# EAGLE design de9-2x5 (EAGLE 6.5.0)
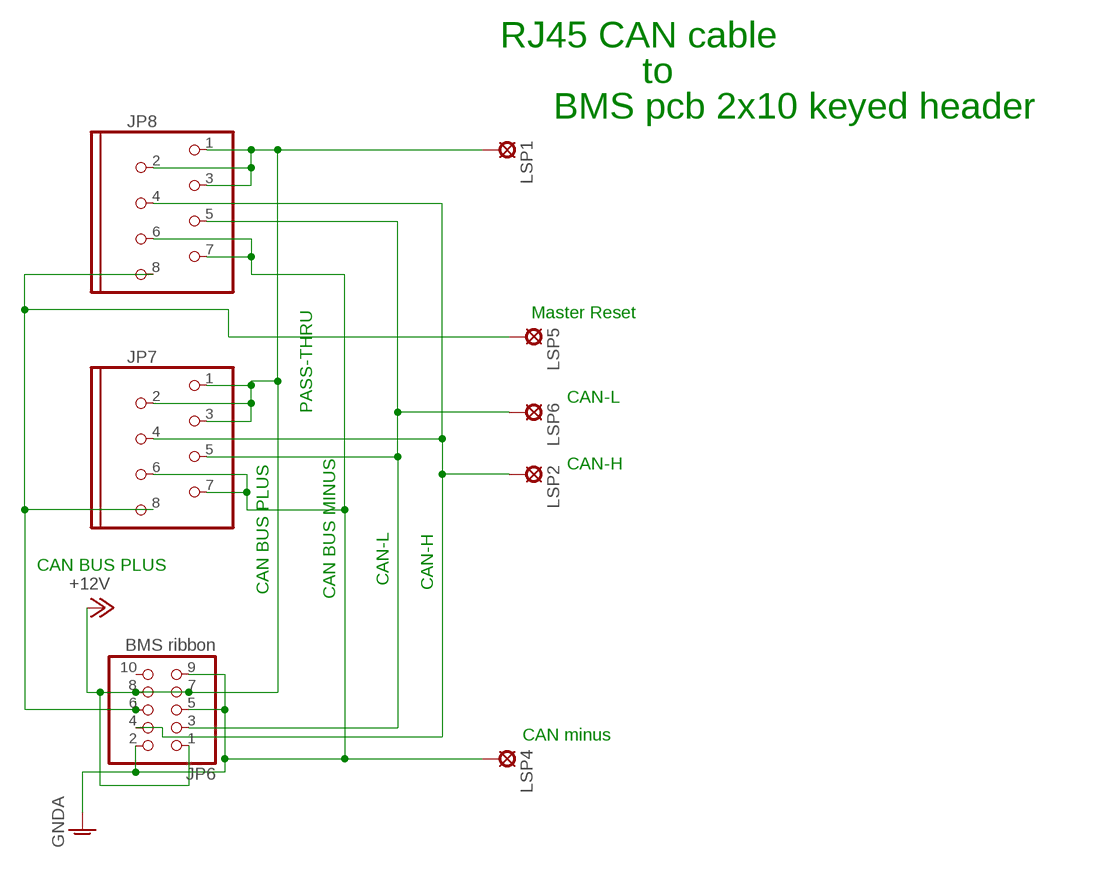
[diagram p0: schematic, sheet 1]

## Parts
JP6  BMS ribbon  PINHD-2X5_KEYED  [2X05_KEYED]
JP7  MOD8P8C  [MOD8P8C]
JP8  MOD8P8C  [MOD8P8C]
LSP1  SE14  [SE14]
LSP2  LSP10  [LSP10]
LSP4  SE14  [SE14]
LSP5  LSP10  [LSP10]
LSP6  LSP10  [LSP10]

## Nets
+12V: JP6.1 JP6.7 JP6.8 JP7.1 JP7.2 JP7.3 JP8.1 JP8.2 JP8.3 LSP1.MP
CANH: JP6.4 JP7.4 JP8.4 LSP2.MP
CANL: JP6.3 JP7.5 JP8.5 LSP6.MP
GNDA: JP6.2 JP6.5 JP6.9 JP7.6 JP7.7 JP8.6 JP8.7 LSP4.MP
MASTER-RESET-SYS: JP6.6 JP7.8 JP8.8 LSP5.MP
Unconnected: JP6.10

## Notes on the sheet
- RJ45 CAN cable
- to
- BMS pcb 2x10 keyed header
- PASS-THRU
- Master Reset
- CAN-L
- CAN-H
- CAN BUS PLUS
- CAN-L | CAN-H
- CAN BUS PLUS | CAN BUS MINUS
- CAN minus

## Library data of the parts
JP6 = pinhead:PINHD-2X5_KEYED
JP7 JP8 = DEH:MOD8P8C
LSP1 LSP4 = solpad:SE14: SOLDER PAD E1553, drill 1,4mm, distributor Buerklin, 07F820
LSP2 LSP5 LSP6 = solpad:LSP10: SOLDER PAD drill 1.0 mm, distributor Buerklin, 12H555

## Board
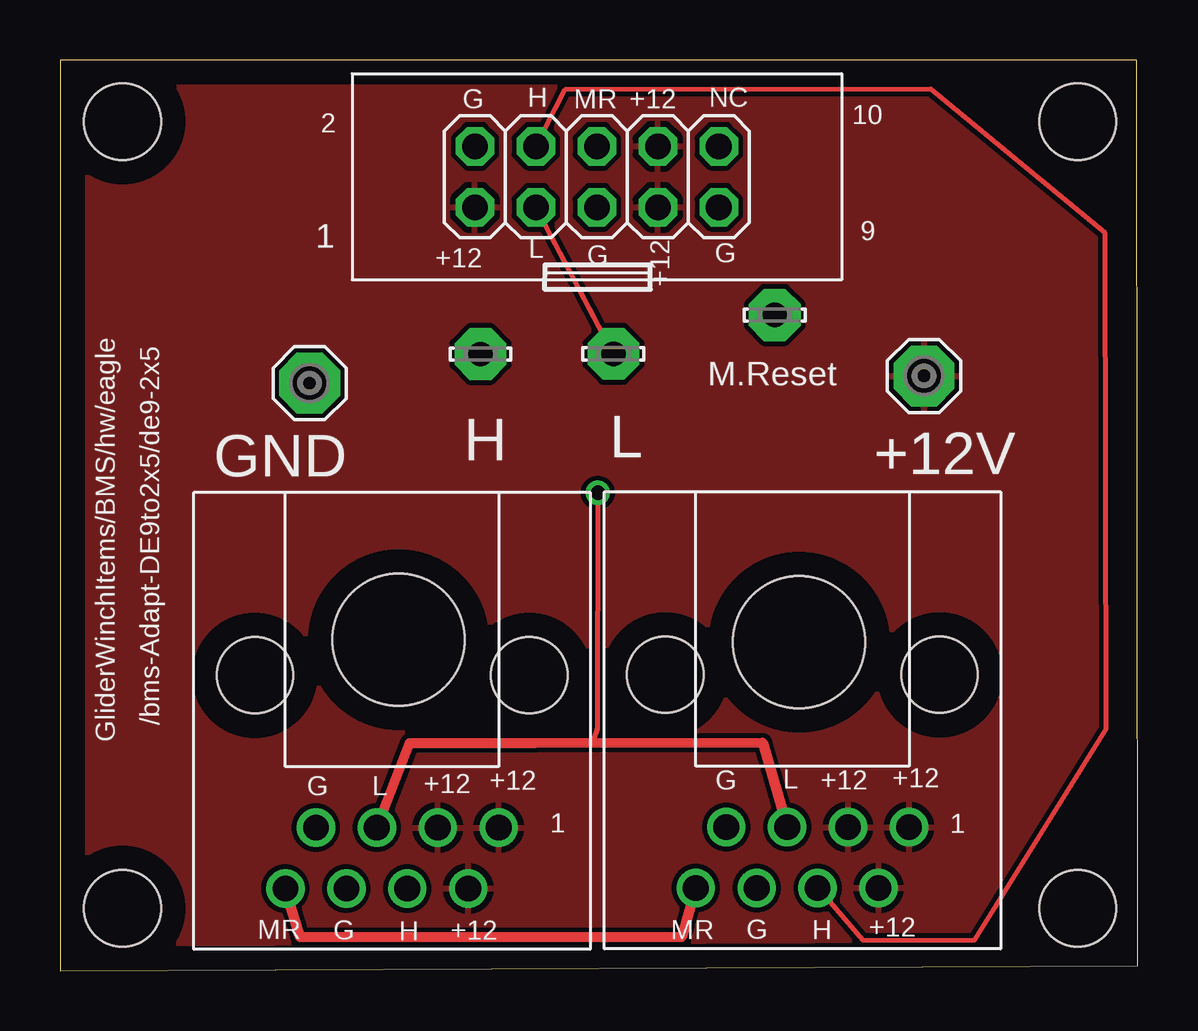
[diagram p1: board, top side]
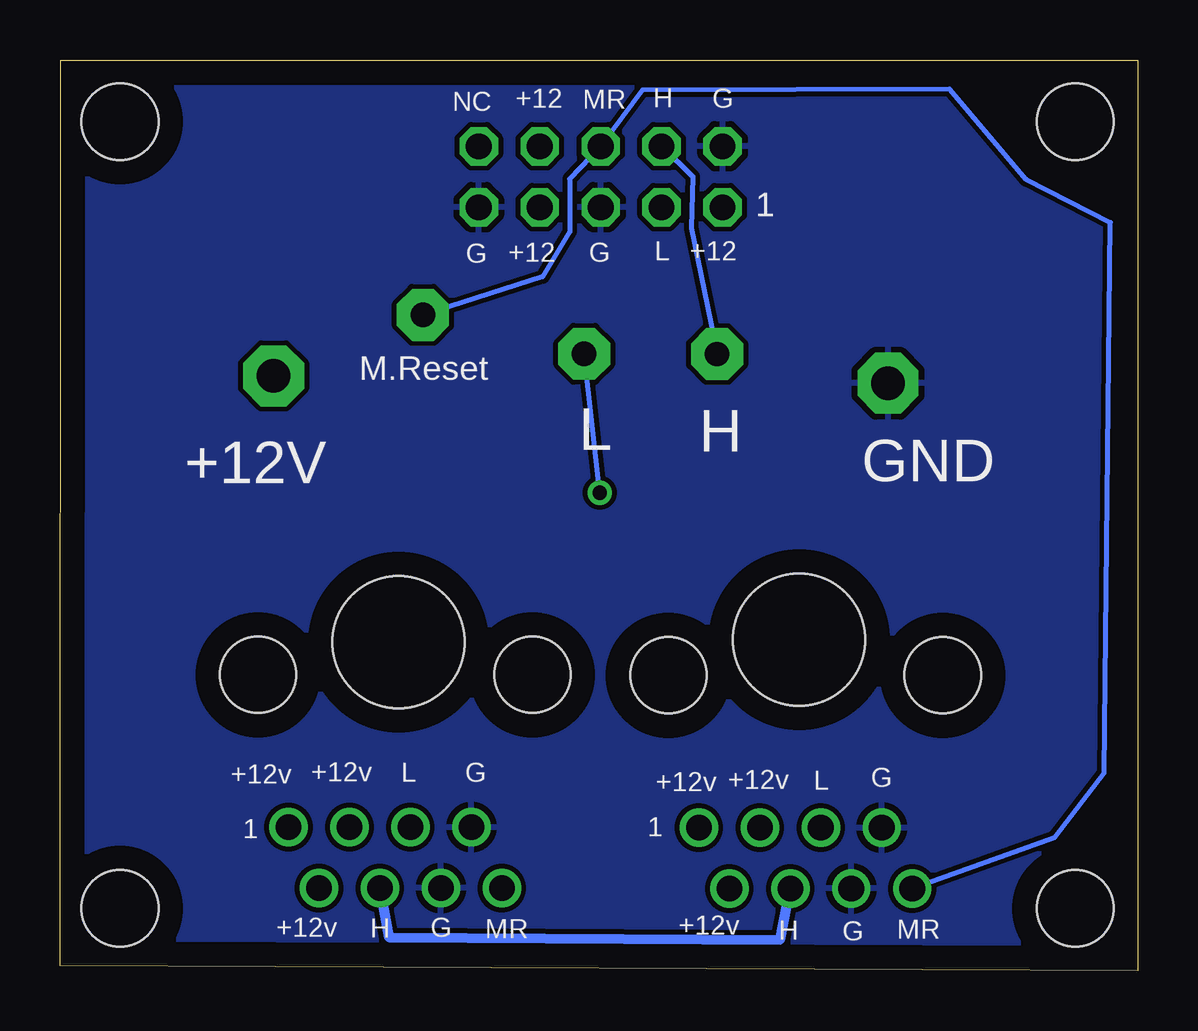
[diagram p2: board, bottom side, seen from below]

Size 44.9 x 37.97 mm. Coordinates in mm from the lower left corner, seen from the top.
Outline: 0,0 44.9,0.2 44.87,37.97 0,37.96 0,0
Copper layers (1*16): Top 0.035mm / dielectric 1.5mm / Bottom 0.035mm
Design rules "default *": minimum track width 8mil, minimum drill 0.6mm, track to track 8mil, track to pad 8mil, pad to pad 8mil, via to via 8mil, smd to smd 0mil, copper to edge 40mil, drill to drill 8mil, minimum pad ring 10mil, minimum via ring 8mil, stop-mask expansion 4mil, vias tented up to drill 0mil, thermal gap 10mil
Holes 5.5 mm at 14.1,13.8 30.8,13.7
Holes 3.2 mm at 2.6,2.6 2.6,35.4 42.4,35.4 42.4,2.6

### Footprints (pad centres in the part's own frame; a part is rotated, then mirrored left to right if it is on the bottom)
2X05_KEYED = drill 1.067 octagon: 1 -5.08,-1.27; 2 -5.08,1.27; 3 -2.54,-1.27; 4 -2.54,1.27; 5 0,-1.27; 6 0,1.27; 7 2.54,-1.27; 8 2.54,1.27; 9 5.08,-1.27; 10 5.08,1.27
MOD8P8C = drill 1.067 pad 1.397: 1 -3.81,-2.54; 2 -2.54,0; 3 -1.27,-2.54; 4 0,0; 5 1.27,-2.54; 6 2.54,0; 7 3.81,-2.54; 8 5.08,0 | hole 3.175: -5.08,-8.89; 6.35,-8.89
SE14 = drill 1.397 pad 2.54 octagon: MP 0,0
LSP10 = drill 1.016 pad 2.159 octagon: MP 0,0

### Placement (x,y rotation side)
JP6  22.37,33.1 0 top
JP7  14.47,3.43 180 top
JP8  31.57,3.45 180 top
LSP1  36,24.8 0 top
LSP2  17.52,25.71 0 top
LSP4  10.4,24.5 0 top
LSP5  29.78,27.34 0 top
LSP6  23.06,25.72 0 top

### Tracks (layer width: path | path; a pad name or v marks a point on that pad's centre or on a via)
+12V
  pour Top: -2.2,38.8 -2.1,-1.8 45.54,-1.95 45.54,38.35 -1.2,38.8
CANH
  Top 0.203: JP8.4 33.45,1.28 38.11,1.29 43.59,10.08 43.55,30.75 36.29,36.76 21.04,36.73 JP6.4
  Bottom 0.203: JP6.4 18.53,33.11 18.59,30.96 LSP2.MP
  Bottom 0.406: JP8.4 31.2,1.4 14.9,1.3 JP7.4
CANL  (via drill 0.6 pad 0.25)
  Top 0.203: v22.41,19.93 22.38,10.07 22.17,9.53 | JP6.3 LSP6.MP
  Top 0.406: JP7.5 14.57,9.5 19.8,9.5 22.17,9.53 29.28,9.51 JP8.5
  Bottom 0.203: v22.41,19.93 LSP6.MP
GNDA
  pour Bottom: -3.1,39.6 -2.7,-2.5 46.64,-2.85 46.44,39.75 -1.9,39.6
MASTER-RESET-SYS
  Top 0.406: JP8.8 25.9,1.4 10,1.4 JP7.8
  Bottom 0.203: JP7.8 3.45,5.57 1.39,8.25 1.13,31.19 4.63,32.99 7.83,36.76 20.63,36.71 JP6.6 23.67,33.02 23.66,30.81 24.79,28.93 LSP5.MP

### Text on the board
tNames: G | +12 | H | MR | NC | 2 | 10 | 1 | +12 | L | G | G | 9 | +12 | M.Reset | GND | H | L | +12V | GliderWinchItems/BMS/hw/eagle | /bms-Adapt-DE9to2x5/de9-2x5 | +12 | G | L | +12 | +12 | G | L | +12 | 1 | 1 | MR | G | H | +12 | MR | G | H | +12
bNames: G | H | MR | +12 | NC | 1 | +12 | L | G | +12 | G | M.Reset | H | L | +12V | GND | G | L | +12v | G | L | +12v | +12v | +12v | 1 | 1 | +12v | MR | G | H | MR | G | H | +12v